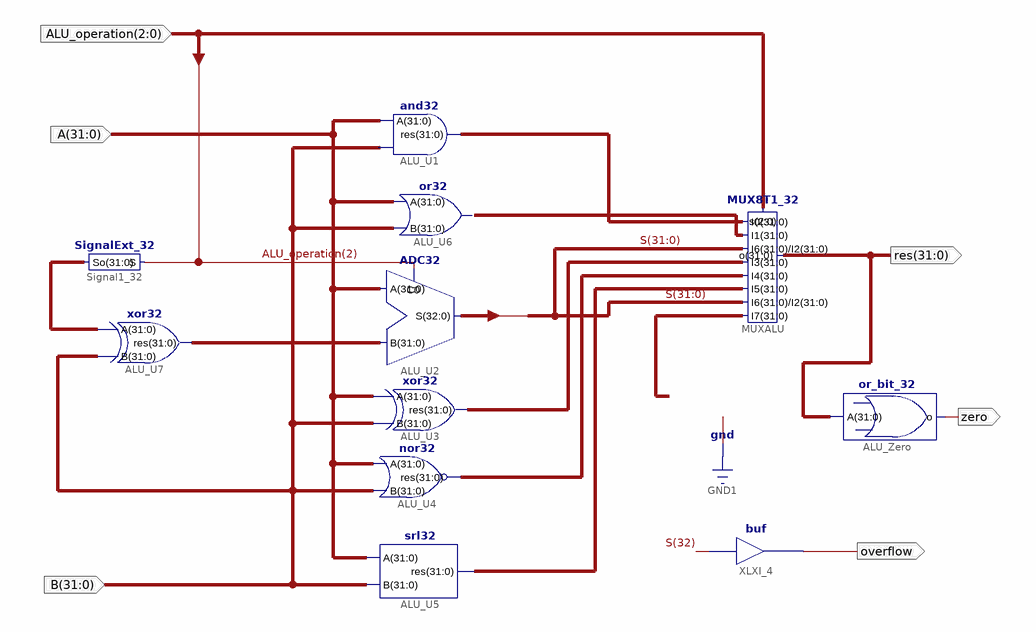
[diagram p0: schematic sheet 1]
// Xilinx ISE schematic ALU.sch (kintex7) as structural Verilog: 11 symbols, 6 ports
module ALU (
  input  [2:0] ALU_operation,
  input  [31:0] A,
  input  [31:0] B,
  output [31:0] res,
  output zero,
  output overflow
);

  wire [31:0] XLXN_3, XLXN_13, XLXN_15, XLXN_16, XLXN_17, XLXN_18, XLXN_20;
  wire [32:0] S;

  and32 ALU_U1 (.res(XLXN_3), .A(A), .B(B));
  ADC32 ALU_U2 (.B(XLXN_15), .A(A), .C0(ALU_operation[2]), .S(S));
  xor32 ALU_U3 (.A(A), .B(B), .res(XLXN_16));
  nor32 ALU_U4 (.res(XLXN_17), .A(A), .B(B));
  srl32 ALU_U5 (.A(A), .B(B), .res(XLXN_18));
  MUX8T1_32 MUXALU (
    .s(ALU_operation), .I7({{31{1'b0}}, S[32]}), .I6(S[31:0]), .I5(XLXN_18), .I4(XLXN_17), .I3(XLXN_16),
    .I2(S[31:0]), .I1(XLXN_20), .I0(XLXN_3), .o(res));
  or_bit_32 ALU_Zero (.o(zero), .A(res));
  SignalExt_32 Signal1_32 (.So(XLXN_13), .S(ALU_operation[2]));
  xor32 ALU_U7 (.A(XLXN_13), .B(B), .res(XLXN_15));
  buf XLXI_4 (overflow, S[32]);
  or32 ALU_U6 (.res(XLXN_20), .A(A), .B(B));
endmodule
